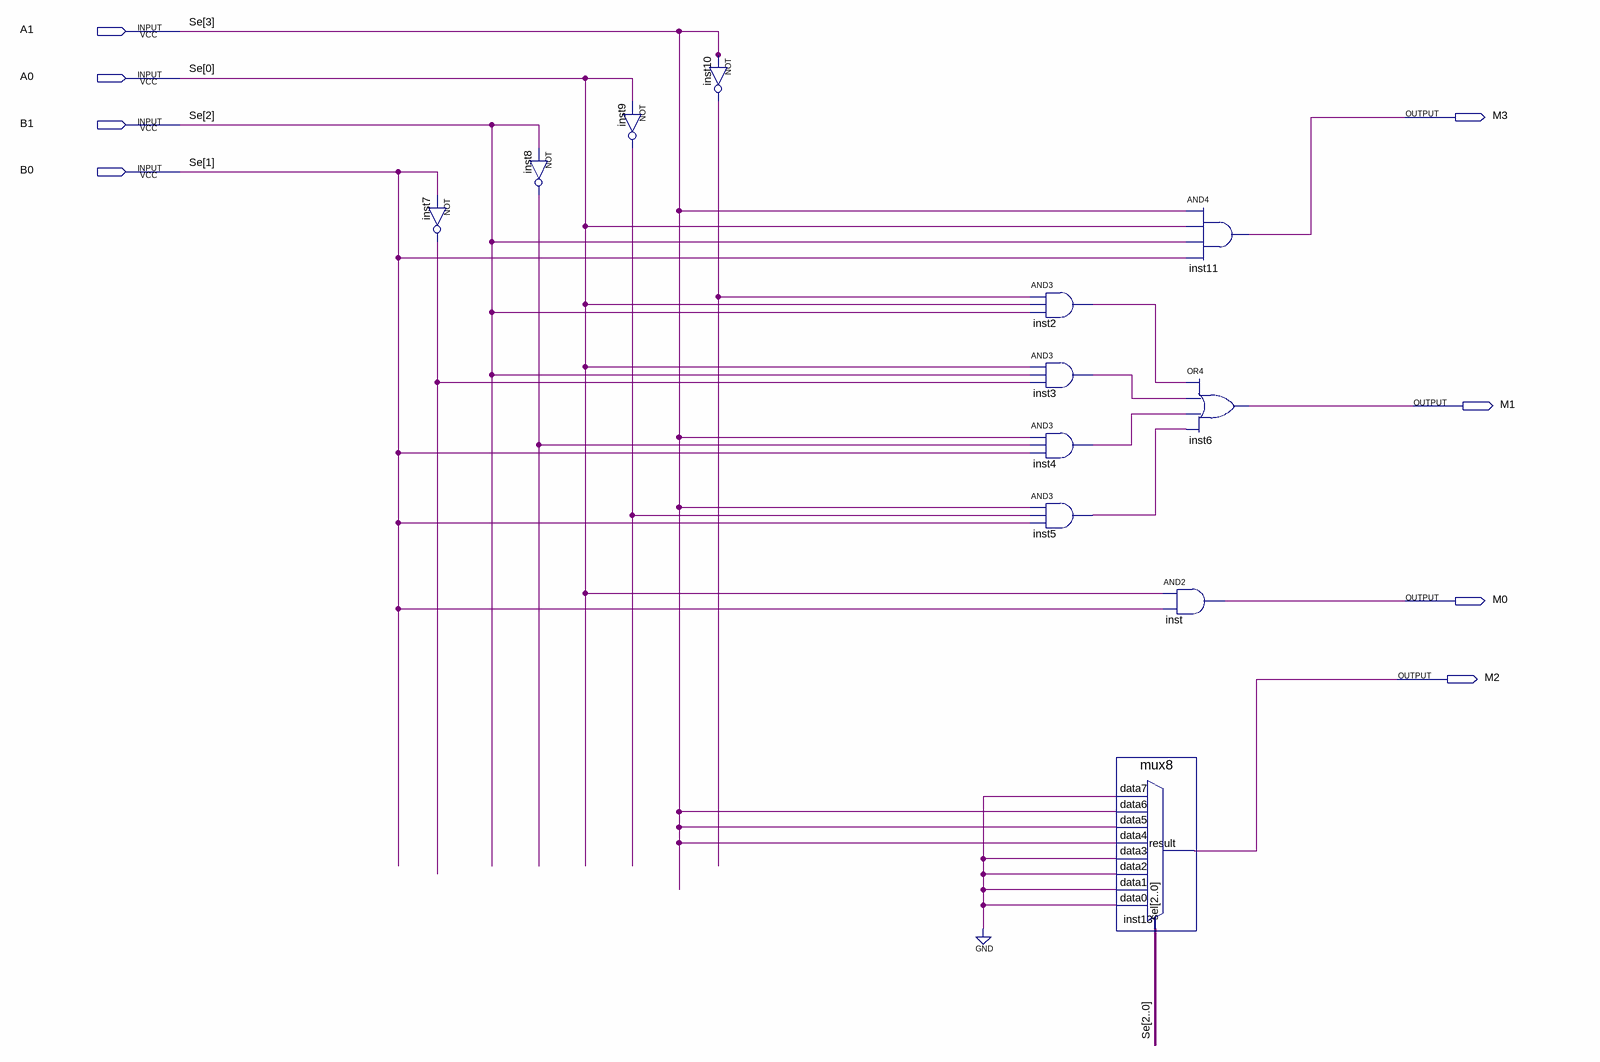
[diagram p0: schematic sheet]
// Quartus schematic Devoir1No2.bdf as structural Verilog: 12 symbols, 8 pins
module Devoir1No2 (
  input  A1,
  input  A0,
  input  B1,
  input  B0,
  output M3,
  output M1,
  output M0,
  output M2
);

  wire inst2_out, inst3_out, inst4_out, inst5_out, inst7_out, inst8_out, inst9_out, inst10_out;

  not inst7 (inst7_out, B0);
  not inst8 (inst8_out, B1);
  not inst9 (inst9_out, A0);
  not inst10 (inst10_out, A1);
  and inst2 (inst2_out, inst10_out, A0, B1);
  and inst3 (inst3_out, A0, B1, inst7_out);
  and inst4 (inst4_out, A1, inst8_out, B0);
  and inst5 (inst5_out, A1, inst9_out, B0);
  mux8 inst13 (
    .data7(1'b0), .data6(A1), .data5(A1), .data4(A1), .data3(1'b0), .data2(1'b0), .data1(1'b0), .data0(1'b0),
    .sel({B1, B0, A0}), .result(M2));
  and inst11 (M3, A1, A0, B1, B0);
  or inst6 (M1, inst2_out, inst3_out, inst4_out, inst5_out);
  and inst (M0, A0, B0);

  // Other names for the same wires on the sheet: Se[3:0] = {A1, B1, B0, A0}
endmodule
